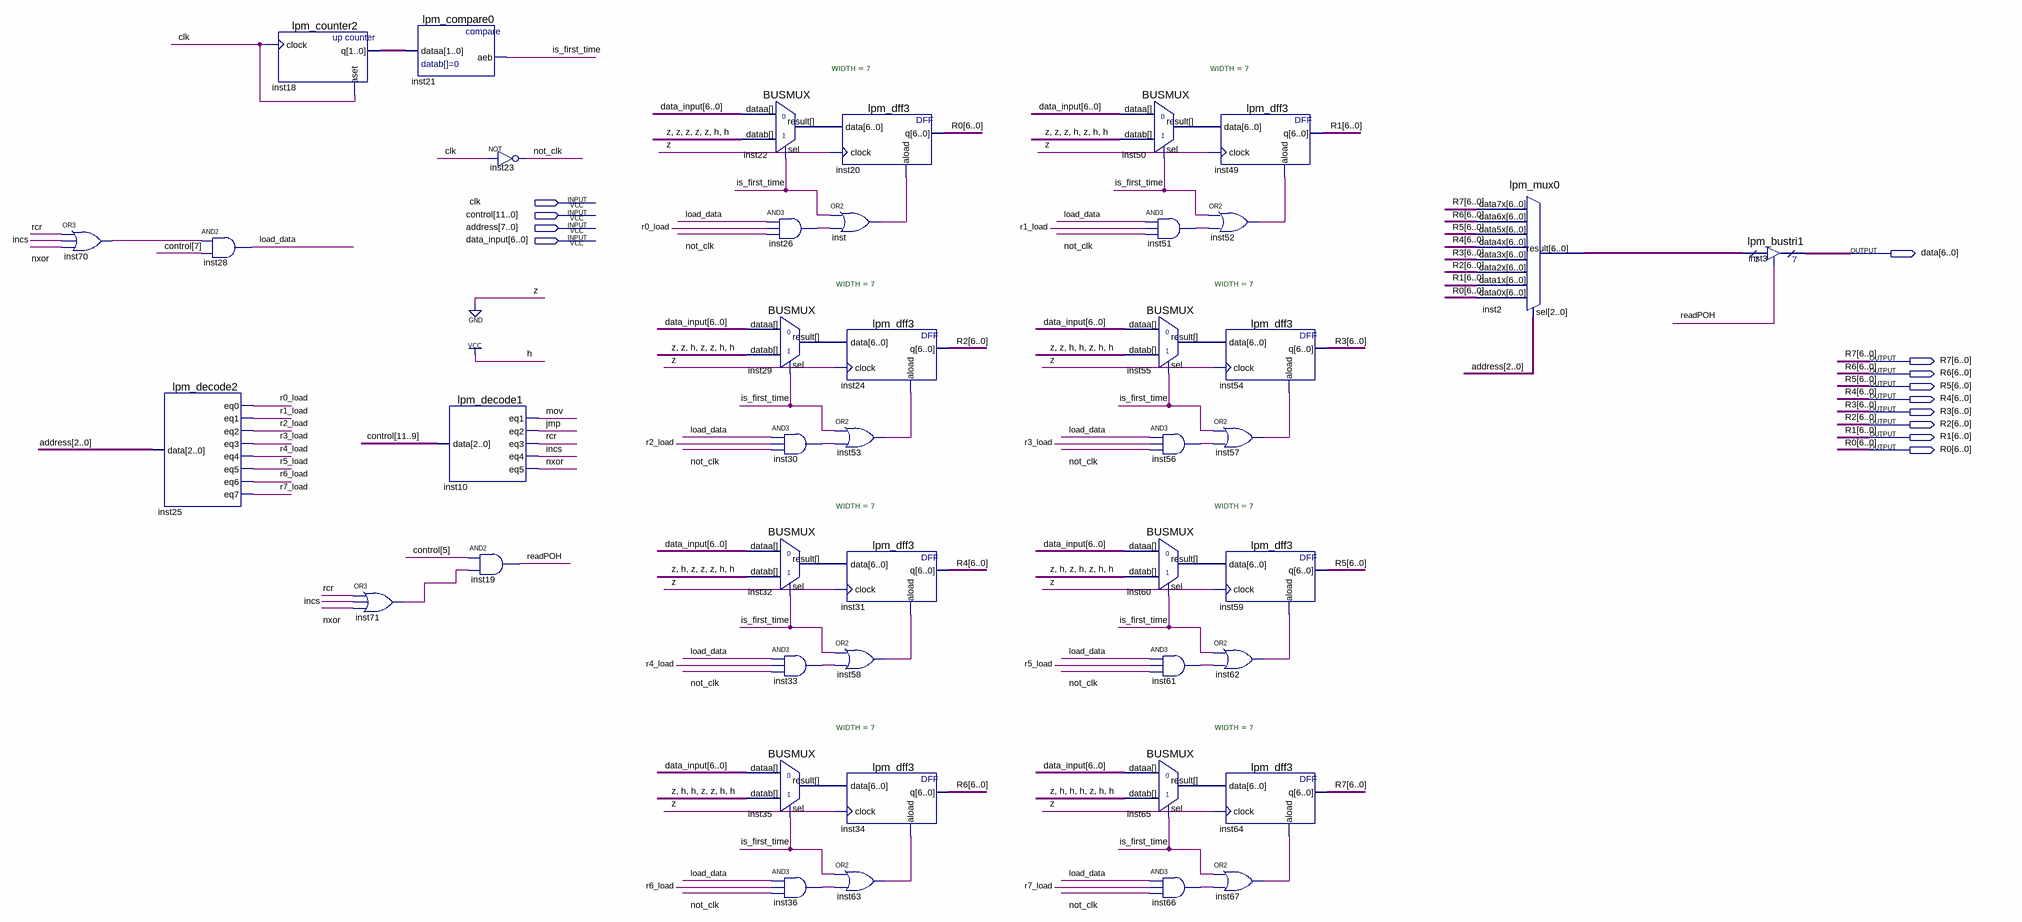
[diagram p0: schematic sheet]
// Quartus schematic POH.bdf as structural Verilog: 43 symbols, 13 pins
module POH (
  input  clk,
  input  [11:0] control,
  input  [7:0] address,
  input  [6:0] data_input,
  output [6:0] data,
  output [6:0] R7,
  output [6:0] R6,
  output [6:0] R5,
  output [6:0] R4,
  output [6:0] R3,
  output [6:0] R2,
  output [6:0] R1,
  output [6:0] R0
);

  wire incs, inst26_out, inst30_out, inst33_out, inst36_out, inst51_out, inst52_out, inst53_out, inst56_out,
       inst57_out, inst58_out, inst61_out, inst62_out, inst63_out, inst66_out, inst67_out, inst70_out,
       inst71_out, inst_out, is_first_time, jmp, load_data, mov, not_clk, nxor, r0_load, r1_load, r2_load,
       r3_load, r4_load, r5_load, r6_load, r7_load, rcr, readPOH;
  wire [1:0] inst18_q;
  wire [6:0] inst2_result, inst22_result, inst29_result, inst32_result, inst35_result, inst50_result,
       inst55_result, inst60_result, inst65_result;

  or inst70 (inst70_out, rcr, incs, nxor);
  and inst28 (load_data, inst70_out, control[7]);
  lpm_decode2 inst25 (
    .data(address[2:0]), .eq0(r0_load), .eq1(r1_load), .eq2(r2_load), .eq3(r3_load), .eq4(r4_load),
    .eq5(r5_load), .eq6(r6_load), .eq7(r7_load));
  lpm_counter2 inst18 (.clock(clk), .aset(clk), .q(inst18_q));
  or inst71 (inst71_out, rcr, incs, nxor);
  lpm_compare0 inst21 (.dataa(inst18_q), .aeb(is_first_time));
  lpm_decode1 inst10 (.data(control[11:9]), .eq1(mov), .eq2(jmp), .eq3(rcr), .eq4(incs), .eq5(nxor));
  not inst23 (not_clk, clk);
  and inst19 (readPOH, control[5], inst71_out);
  BUSMUX #(.WIDTH(7)) inst22 (.datab(7'b0000011), .sel(is_first_time), .dataa(data_input), .result(inst22_result));
  BUSMUX #(.WIDTH(7)) inst29 (.datab(7'b0010011), .sel(is_first_time), .dataa(data_input), .result(inst29_result));
  BUSMUX #(.WIDTH(7)) inst32 (.datab(7'b0100011), .sel(is_first_time), .dataa(data_input), .result(inst32_result));
  BUSMUX #(.WIDTH(7)) inst35 (.datab(7'b0110011), .sel(is_first_time), .dataa(data_input), .result(inst35_result));
  and inst26 (inst26_out, load_data, r0_load, not_clk);
  and inst30 (inst30_out, load_data, r2_load, not_clk);
  and inst33 (inst33_out, load_data, r4_load, not_clk);
  and inst36 (inst36_out, load_data, r6_load, not_clk);
  lpm_dff3 inst20 (.data(inst22_result), .clock(1'b0), .aload(inst_out), .q(R0));
  or inst (inst_out, is_first_time, inst26_out);
  lpm_dff3 inst24 (.data(inst29_result), .clock(1'b0), .aload(inst53_out), .q(R2));
  or inst53 (inst53_out, is_first_time, inst30_out);
  lpm_dff3 inst31 (.data(inst32_result), .clock(1'b0), .aload(inst58_out), .q(R4));
  or inst58 (inst58_out, is_first_time, inst33_out);
  lpm_dff3 inst34 (.data(inst35_result), .clock(1'b0), .aload(inst63_out), .q(R6));
  or inst63 (inst63_out, is_first_time, inst36_out);
  BUSMUX #(.WIDTH(7)) inst50 (.datab(7'b0001011), .sel(is_first_time), .dataa(data_input), .result(inst50_result));
  and inst51 (inst51_out, load_data, r1_load, not_clk);
  BUSMUX #(.WIDTH(7)) inst55 (.datab(7'b0011011), .sel(is_first_time), .dataa(data_input), .result(inst55_result));
  and inst56 (inst56_out, load_data, r3_load, not_clk);
  BUSMUX #(.WIDTH(7)) inst60 (.datab(7'b0101011), .sel(is_first_time), .dataa(data_input), .result(inst60_result));
  and inst61 (inst61_out, load_data, r5_load, not_clk);
  BUSMUX #(.WIDTH(7)) inst65 (.datab(7'b0111011), .sel(is_first_time), .dataa(data_input), .result(inst65_result));
  and inst66 (inst66_out, load_data, r7_load, not_clk);
  lpm_dff3 inst49 (.data(inst50_result), .clock(1'b0), .aload(inst52_out), .q(R1));
  or inst52 (inst52_out, is_first_time, inst51_out);
  lpm_dff3 inst54 (.data(inst55_result), .clock(1'b0), .aload(inst57_out), .q(R3));
  or inst57 (inst57_out, is_first_time, inst56_out);
  lpm_dff3 inst59 (.data(inst60_result), .clock(1'b0), .aload(inst62_out), .q(R5));
  or inst62 (inst62_out, is_first_time, inst61_out);
  lpm_dff3 inst64 (.data(inst65_result), .clock(1'b0), .aload(inst67_out), .q(R7));
  or inst67 (inst67_out, is_first_time, inst66_out);
  lpm_mux0 inst2 (
    .data7x(R7), .data6x(R6), .data5x(R5), .data4x(R4), .data3x(R3), .data2x(R2), .data1x(R1), .data0x(R0),
    .sel(address[2:0]), .result(inst2_result));
  lpm_bustri1 inst3 (.enabledt(readPOH), .data(inst2_result), .tridata(data));
endmodule
